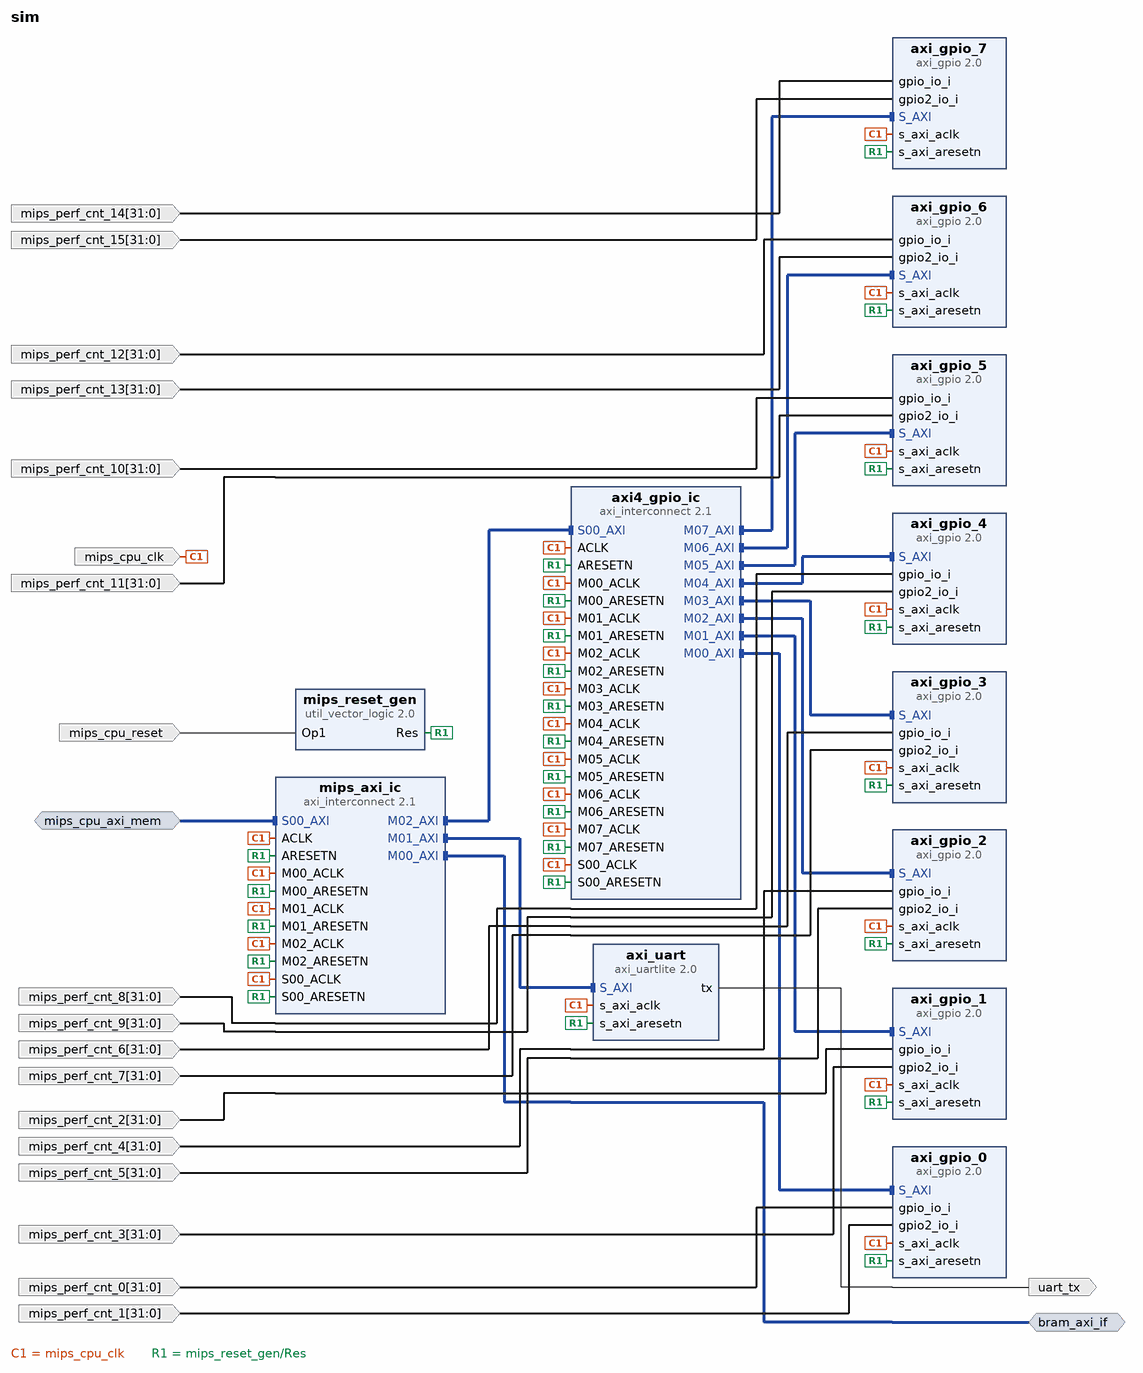
[diagram p0: block diagram of the top level]
# Vivado block design sim, xczu2eg-sfva625-1-e, Vivado 2017.2
create_bd_design sim

create_bd_intf_port -mode Slave -vlnv xilinx.com:interface:aximm_rtl:1.0 mips_cpu_axi_mem
set_property -dict [list \
  CONFIG.DATA_WIDTH 32 \
  CONFIG.PROTOCOL AXI4LITE \
  CONFIG.ID_WIDTH 0 \
  CONFIG.ADDR_WIDTH 32 \
  CONFIG.AWUSER_WIDTH 0 \
  CONFIG.ARUSER_WIDTH 0 \
  CONFIG.WUSER_WIDTH 0 \
  CONFIG.RUSER_WIDTH 0 \
  CONFIG.BUSER_WIDTH 0 \
  CONFIG.READ_WRITE_MODE READ_WRITE \
  CONFIG.HAS_BURST 1 \
  CONFIG.HAS_LOCK 1 \
  CONFIG.HAS_PROT 1 \
  CONFIG.HAS_CACHE 1 \
  CONFIG.HAS_QOS 1 \
  CONFIG.HAS_REGION 1 \
  CONFIG.HAS_WSTRB 1 \
  CONFIG.HAS_BRESP 1 \
  CONFIG.HAS_RRESP 1 \
  CONFIG.SUPPORTS_NARROW_BURST 0 \
  CONFIG.NUM_READ_OUTSTANDING 1 \
  CONFIG.NUM_WRITE_OUTSTANDING 1 \
  CONFIG.MAX_BURST_LENGTH 1 \
  CONFIG.NUM_READ_THREADS 1 \
  CONFIG.NUM_WRITE_THREADS 1 \
  CONFIG.RUSER_BITS_PER_BYTE 0 \
  CONFIG.WUSER_BITS_PER_BYTE 0 \
] [get_bd_intf_ports mips_cpu_axi_mem]
create_bd_intf_port -mode Master -vlnv xilinx.com:interface:aximm_rtl:1.0 bram_axi_if
set_property -dict {CONFIG.DATA_WIDTH 32 CONFIG.PROTOCOL AXI4 CONFIG.ADDR_WIDTH 32} [get_bd_intf_ports bram_axi_if]
create_bd_port -dir I -type clk mips_cpu_clk
set_property -dict {CONFIG.ASSOCIATED_BUSIF mips_cpu_axi_mem:bram_axi_if} [get_bd_ports mips_cpu_clk]
create_bd_port -dir I -type rst mips_cpu_reset
create_bd_port -dir I -from 31 -to 0 mips_perf_cnt_0
create_bd_port -dir I -from 31 -to 0 mips_perf_cnt_1
create_bd_port -dir I -from 31 -to 0 mips_perf_cnt_2
create_bd_port -dir I -from 31 -to 0 mips_perf_cnt_3
create_bd_port -dir I -from 31 -to 0 mips_perf_cnt_4
create_bd_port -dir I -from 31 -to 0 mips_perf_cnt_5
create_bd_port -dir I -from 31 -to 0 mips_perf_cnt_6
create_bd_port -dir I -from 31 -to 0 mips_perf_cnt_7
create_bd_port -dir I -from 31 -to 0 mips_perf_cnt_8
create_bd_port -dir I -from 31 -to 0 mips_perf_cnt_9
create_bd_port -dir I -from 31 -to 0 mips_perf_cnt_10
create_bd_port -dir I -from 31 -to 0 mips_perf_cnt_11
create_bd_port -dir I -from 31 -to 0 mips_perf_cnt_12
create_bd_port -dir I -from 31 -to 0 mips_perf_cnt_13
create_bd_port -dir I -from 31 -to 0 mips_perf_cnt_14
create_bd_port -dir I -from 31 -to 0 mips_perf_cnt_15
create_bd_port -dir O uart_tx

create_bd_cell -type ip -vlnv xilinx.com:ip:axi_interconnect:2.1 mips_axi_ic
set_property -dict {CONFIG.NUM_SI 1 CONFIG.NUM_MI 3} [get_bd_cells mips_axi_ic]
create_bd_cell -type ip -vlnv xilinx.com:ip:axi_uartlite:2.0 axi_uart
set_property -dict {CONFIG.C_BAUDRATE 115200} [get_bd_cells axi_uart]
create_bd_cell -type ip -vlnv xilinx.com:ip:axi_gpio:2.0 axi_gpio_0
set_property -dict [list \
  CONFIG.C_GPIO_WIDTH 32 \
  CONFIG.C_GPIO2_WIDTH 32 \
  CONFIG.C_IS_DUAL 1 \
  CONFIG.C_ALL_INPUTS 1 \
  CONFIG.C_ALL_INPUTS_2 1 \
] [get_bd_cells axi_gpio_0]
create_bd_cell -type ip -vlnv xilinx.com:ip:axi_gpio:2.0 axi_gpio_1
set_property -dict [list \
  CONFIG.C_GPIO_WIDTH 32 \
  CONFIG.C_GPIO2_WIDTH 32 \
  CONFIG.C_IS_DUAL 1 \
  CONFIG.C_ALL_INPUTS 1 \
  CONFIG.C_ALL_INPUTS_2 1 \
] [get_bd_cells axi_gpio_1]
create_bd_cell -type ip -vlnv xilinx.com:ip:axi_gpio:2.0 axi_gpio_2
set_property -dict [list \
  CONFIG.C_GPIO_WIDTH 32 \
  CONFIG.C_GPIO2_WIDTH 32 \
  CONFIG.C_IS_DUAL 1 \
  CONFIG.C_ALL_INPUTS 1 \
  CONFIG.C_ALL_INPUTS_2 1 \
] [get_bd_cells axi_gpio_2]
create_bd_cell -type ip -vlnv xilinx.com:ip:axi_gpio:2.0 axi_gpio_3
set_property -dict [list \
  CONFIG.C_GPIO_WIDTH 32 \
  CONFIG.C_GPIO2_WIDTH 32 \
  CONFIG.C_IS_DUAL 1 \
  CONFIG.C_ALL_INPUTS 1 \
  CONFIG.C_ALL_INPUTS_2 1 \
] [get_bd_cells axi_gpio_3]
create_bd_cell -type ip -vlnv xilinx.com:ip:axi_gpio:2.0 axi_gpio_4
set_property -dict [list \
  CONFIG.C_GPIO_WIDTH 32 \
  CONFIG.C_GPIO2_WIDTH 32 \
  CONFIG.C_IS_DUAL 1 \
  CONFIG.C_ALL_INPUTS 1 \
  CONFIG.C_ALL_INPUTS_2 1 \
] [get_bd_cells axi_gpio_4]
create_bd_cell -type ip -vlnv xilinx.com:ip:axi_gpio:2.0 axi_gpio_5
set_property -dict [list \
  CONFIG.C_GPIO_WIDTH 32 \
  CONFIG.C_GPIO2_WIDTH 32 \
  CONFIG.C_IS_DUAL 1 \
  CONFIG.C_ALL_INPUTS 1 \
  CONFIG.C_ALL_INPUTS_2 1 \
] [get_bd_cells axi_gpio_5]
create_bd_cell -type ip -vlnv xilinx.com:ip:axi_gpio:2.0 axi_gpio_6
set_property -dict [list \
  CONFIG.C_GPIO_WIDTH 32 \
  CONFIG.C_GPIO2_WIDTH 32 \
  CONFIG.C_IS_DUAL 1 \
  CONFIG.C_ALL_INPUTS 1 \
  CONFIG.C_ALL_INPUTS_2 1 \
] [get_bd_cells axi_gpio_6]
create_bd_cell -type ip -vlnv xilinx.com:ip:axi_gpio:2.0 axi_gpio_7
set_property -dict [list \
  CONFIG.C_GPIO_WIDTH 32 \
  CONFIG.C_GPIO2_WIDTH 32 \
  CONFIG.C_IS_DUAL 1 \
  CONFIG.C_ALL_INPUTS 1 \
  CONFIG.C_ALL_INPUTS_2 1 \
] [get_bd_cells axi_gpio_7]
create_bd_cell -type ip -vlnv xilinx.com:ip:axi_interconnect:2.1 axi4_gpio_ic
set_property -dict {CONFIG.NUM_SI 1 CONFIG.NUM_MI 8} [get_bd_cells axi4_gpio_ic]
create_bd_cell -type ip -vlnv xilinx.com:ip:util_vector_logic:2.0 mips_reset_gen
set_property -dict {CONFIG.C_SIZE 1 CONFIG.C_OPERATION not} [get_bd_cells mips_reset_gen]

# ---- connections ----

connect_bd_intf_net [get_bd_intf_pins mips_axi_ic/M01_AXI] [get_bd_intf_pins axi_uart/S_AXI]
connect_bd_intf_net -intf_net axi_gpio_ic_s [get_bd_intf_pins mips_axi_ic/M02_AXI] [get_bd_intf_pins axi4_gpio_ic/S00_AXI]
connect_bd_intf_net -intf_net axi_gpio_ic_m_0 [get_bd_intf_pins axi4_gpio_ic/M00_AXI] [get_bd_intf_pins axi_gpio_0/S_AXI]
connect_bd_intf_net -intf_net axi_gpio_ic_m_1 [get_bd_intf_pins axi4_gpio_ic/M01_AXI] [get_bd_intf_pins axi_gpio_1/S_AXI]
connect_bd_intf_net -intf_net axi_gpio_ic_m_2 [get_bd_intf_pins axi4_gpio_ic/M02_AXI] [get_bd_intf_pins axi_gpio_2/S_AXI]
connect_bd_intf_net -intf_net axi_gpio_ic_m_3 [get_bd_intf_pins axi4_gpio_ic/M03_AXI] [get_bd_intf_pins axi_gpio_3/S_AXI]
connect_bd_intf_net -intf_net axi_gpio_ic_m_4 [get_bd_intf_pins axi4_gpio_ic/M04_AXI] [get_bd_intf_pins axi_gpio_4/S_AXI]
connect_bd_intf_net -intf_net axi_gpio_ic_m_5 [get_bd_intf_pins axi4_gpio_ic/M05_AXI] [get_bd_intf_pins axi_gpio_5/S_AXI]
connect_bd_intf_net -intf_net axi_gpio_ic_m_6 [get_bd_intf_pins axi4_gpio_ic/M06_AXI] [get_bd_intf_pins axi_gpio_6/S_AXI]
connect_bd_intf_net -intf_net axi_gpio_ic_m_7 [get_bd_intf_pins axi4_gpio_ic/M07_AXI] [get_bd_intf_pins axi_gpio_7/S_AXI]
connect_bd_intf_net -intf_net mips_cpu_master [get_bd_intf_ports mips_cpu_axi_mem] [get_bd_intf_pins mips_axi_ic/S00_AXI]
connect_bd_intf_net -intf_net axi_ddr_if [get_bd_intf_ports bram_axi_if] [get_bd_intf_pins mips_axi_ic/M00_AXI]
connect_bd_net -net mips_clk [get_bd_ports mips_cpu_clk] \
  [get_bd_pins mips_axi_ic/ACLK] [get_bd_pins mips_axi_ic/M00_ACLK] [get_bd_pins mips_axi_ic/M01_ACLK] \
  [get_bd_pins mips_axi_ic/M02_ACLK] [get_bd_pins mips_axi_ic/S00_ACLK] [get_bd_pins axi_uart/s_axi_aclk] \
  [get_bd_pins axi4_gpio_ic/ACLK] [get_bd_pins axi4_gpio_ic/M00_ACLK] [get_bd_pins axi4_gpio_ic/M01_ACLK] \
  [get_bd_pins axi4_gpio_ic/M02_ACLK] [get_bd_pins axi4_gpio_ic/M03_ACLK] [get_bd_pins axi4_gpio_ic/M04_ACLK] \
  [get_bd_pins axi4_gpio_ic/M05_ACLK] [get_bd_pins axi4_gpio_ic/M06_ACLK] [get_bd_pins axi4_gpio_ic/M07_ACLK] \
  [get_bd_pins axi4_gpio_ic/S00_ACLK] [get_bd_pins axi_gpio_0/s_axi_aclk] [get_bd_pins axi_gpio_1/s_axi_aclk] \
  [get_bd_pins axi_gpio_2/s_axi_aclk] [get_bd_pins axi_gpio_3/s_axi_aclk] [get_bd_pins axi_gpio_4/s_axi_aclk] \
  [get_bd_pins axi_gpio_5/s_axi_aclk] [get_bd_pins axi_gpio_6/s_axi_aclk] [get_bd_pins axi_gpio_7/s_axi_aclk]
connect_bd_net -net mips_reset_n_gen [get_bd_ports mips_cpu_reset] [get_bd_pins mips_reset_gen/Op1]
connect_bd_net -net mips_cpu_resetn [get_bd_pins mips_reset_gen/Res] \
  [get_bd_pins mips_axi_ic/ARESETN] [get_bd_pins mips_axi_ic/M00_ARESETN] [get_bd_pins mips_axi_ic/M01_ARESETN] \
  [get_bd_pins mips_axi_ic/M02_ARESETN] [get_bd_pins mips_axi_ic/S00_ARESETN] [get_bd_pins axi4_gpio_ic/ARESETN] \
  [get_bd_pins axi4_gpio_ic/M00_ARESETN] [get_bd_pins axi4_gpio_ic/M01_ARESETN] [get_bd_pins axi4_gpio_ic/M02_ARESETN] \
  [get_bd_pins axi4_gpio_ic/M03_ARESETN] [get_bd_pins axi4_gpio_ic/M04_ARESETN] [get_bd_pins axi4_gpio_ic/M05_ARESETN] \
  [get_bd_pins axi4_gpio_ic/M06_ARESETN] [get_bd_pins axi4_gpio_ic/M07_ARESETN] [get_bd_pins axi4_gpio_ic/S00_ARESETN] \
  [get_bd_pins axi_uart/s_axi_aresetn] [get_bd_pins axi_gpio_0/s_axi_aresetn] [get_bd_pins axi_gpio_1/s_axi_aresetn] \
  [get_bd_pins axi_gpio_2/s_axi_aresetn] [get_bd_pins axi_gpio_3/s_axi_aresetn] [get_bd_pins axi_gpio_4/s_axi_aresetn] \
  [get_bd_pins axi_gpio_5/s_axi_aresetn] [get_bd_pins axi_gpio_6/s_axi_aresetn] [get_bd_pins axi_gpio_7/s_axi_aresetn]
connect_bd_net -net uart_tx [get_bd_pins axi_uart/tx] [get_bd_ports uart_tx]
connect_bd_net -net mips_perf_cnt_0_1 [get_bd_ports mips_perf_cnt_0] [get_bd_pins axi_gpio_0/gpio_io_i]
connect_bd_net -net mips_perf_cnt_1_1 [get_bd_ports mips_perf_cnt_1] [get_bd_pins axi_gpio_0/gpio2_io_i]
connect_bd_net -net mips_perf_cnt_2_1 [get_bd_ports mips_perf_cnt_2] [get_bd_pins axi_gpio_1/gpio_io_i]
connect_bd_net -net mips_perf_cnt_3_1 [get_bd_ports mips_perf_cnt_3] [get_bd_pins axi_gpio_1/gpio2_io_i]
connect_bd_net -net mips_perf_cnt_4_1 [get_bd_ports mips_perf_cnt_4] [get_bd_pins axi_gpio_2/gpio_io_i]
connect_bd_net -net mips_perf_cnt_5_1 [get_bd_ports mips_perf_cnt_5] [get_bd_pins axi_gpio_2/gpio2_io_i]
connect_bd_net -net mips_perf_cnt_6_1 [get_bd_ports mips_perf_cnt_6] [get_bd_pins axi_gpio_3/gpio_io_i]
connect_bd_net -net mips_perf_cnt_7_1 [get_bd_ports mips_perf_cnt_7] [get_bd_pins axi_gpio_3/gpio2_io_i]
connect_bd_net -net mips_perf_cnt_8_1 [get_bd_ports mips_perf_cnt_8] [get_bd_pins axi_gpio_4/gpio_io_i]
connect_bd_net -net mips_perf_cnt_9_1 [get_bd_ports mips_perf_cnt_9] [get_bd_pins axi_gpio_4/gpio2_io_i]
connect_bd_net -net mips_perf_cnt_10_1 [get_bd_ports mips_perf_cnt_10] [get_bd_pins axi_gpio_5/gpio_io_i]
connect_bd_net -net mips_perf_cnt_11_1 [get_bd_ports mips_perf_cnt_11] [get_bd_pins axi_gpio_5/gpio2_io_i]
connect_bd_net -net mips_perf_cnt_12_1 [get_bd_ports mips_perf_cnt_12] [get_bd_pins axi_gpio_6/gpio_io_i]
connect_bd_net -net mips_perf_cnt_13_1 [get_bd_ports mips_perf_cnt_13] [get_bd_pins axi_gpio_6/gpio2_io_i]
connect_bd_net -net mips_perf_cnt_14_1 [get_bd_ports mips_perf_cnt_14] [get_bd_pins axi_gpio_7/gpio_io_i]
connect_bd_net -net mips_perf_cnt_15_1 [get_bd_ports mips_perf_cnt_15] [get_bd_pins axi_gpio_7/gpio2_io_i]

# ---- address map ----
assign_bd_address -offset 0x40000000 -range 64K -target_address_space [get_bd_addr_spaces mips_cpu_axi_mem] [get_bd_addr_segs bram_axi_if/Reg]
assign_bd_address -offset 0x40010000 -range 4K -target_address_space [get_bd_addr_spaces mips_cpu_axi_mem] [get_bd_addr_segs axi_uart/S_AXI/Reg]
assign_bd_address -offset 0x40020000 -range 4K -target_address_space [get_bd_addr_spaces mips_cpu_axi_mem] [get_bd_addr_segs axi_gpio_0/S_AXI/Reg]
assign_bd_address -offset 0x40021000 -range 4K -target_address_space [get_bd_addr_spaces mips_cpu_axi_mem] [get_bd_addr_segs axi_gpio_1/S_AXI/Reg]
assign_bd_address -offset 0x40022000 -range 4K -target_address_space [get_bd_addr_spaces mips_cpu_axi_mem] [get_bd_addr_segs axi_gpio_2/S_AXI/Reg]
assign_bd_address -offset 0x40023000 -range 4K -target_address_space [get_bd_addr_spaces mips_cpu_axi_mem] [get_bd_addr_segs axi_gpio_3/S_AXI/Reg]
assign_bd_address -offset 0x40024000 -range 4K -target_address_space [get_bd_addr_spaces mips_cpu_axi_mem] [get_bd_addr_segs axi_gpio_4/S_AXI/Reg]
assign_bd_address -offset 0x40025000 -range 4K -target_address_space [get_bd_addr_spaces mips_cpu_axi_mem] [get_bd_addr_segs axi_gpio_5/S_AXI/Reg]
assign_bd_address -offset 0x40026000 -range 4K -target_address_space [get_bd_addr_spaces mips_cpu_axi_mem] [get_bd_addr_segs axi_gpio_6/S_AXI/Reg]
assign_bd_address -offset 0x40027000 -range 4K -target_address_space [get_bd_addr_spaces mips_cpu_axi_mem] [get_bd_addr_segs axi_gpio_7/S_AXI/Reg]

validate_bd_design
save_bd_design
